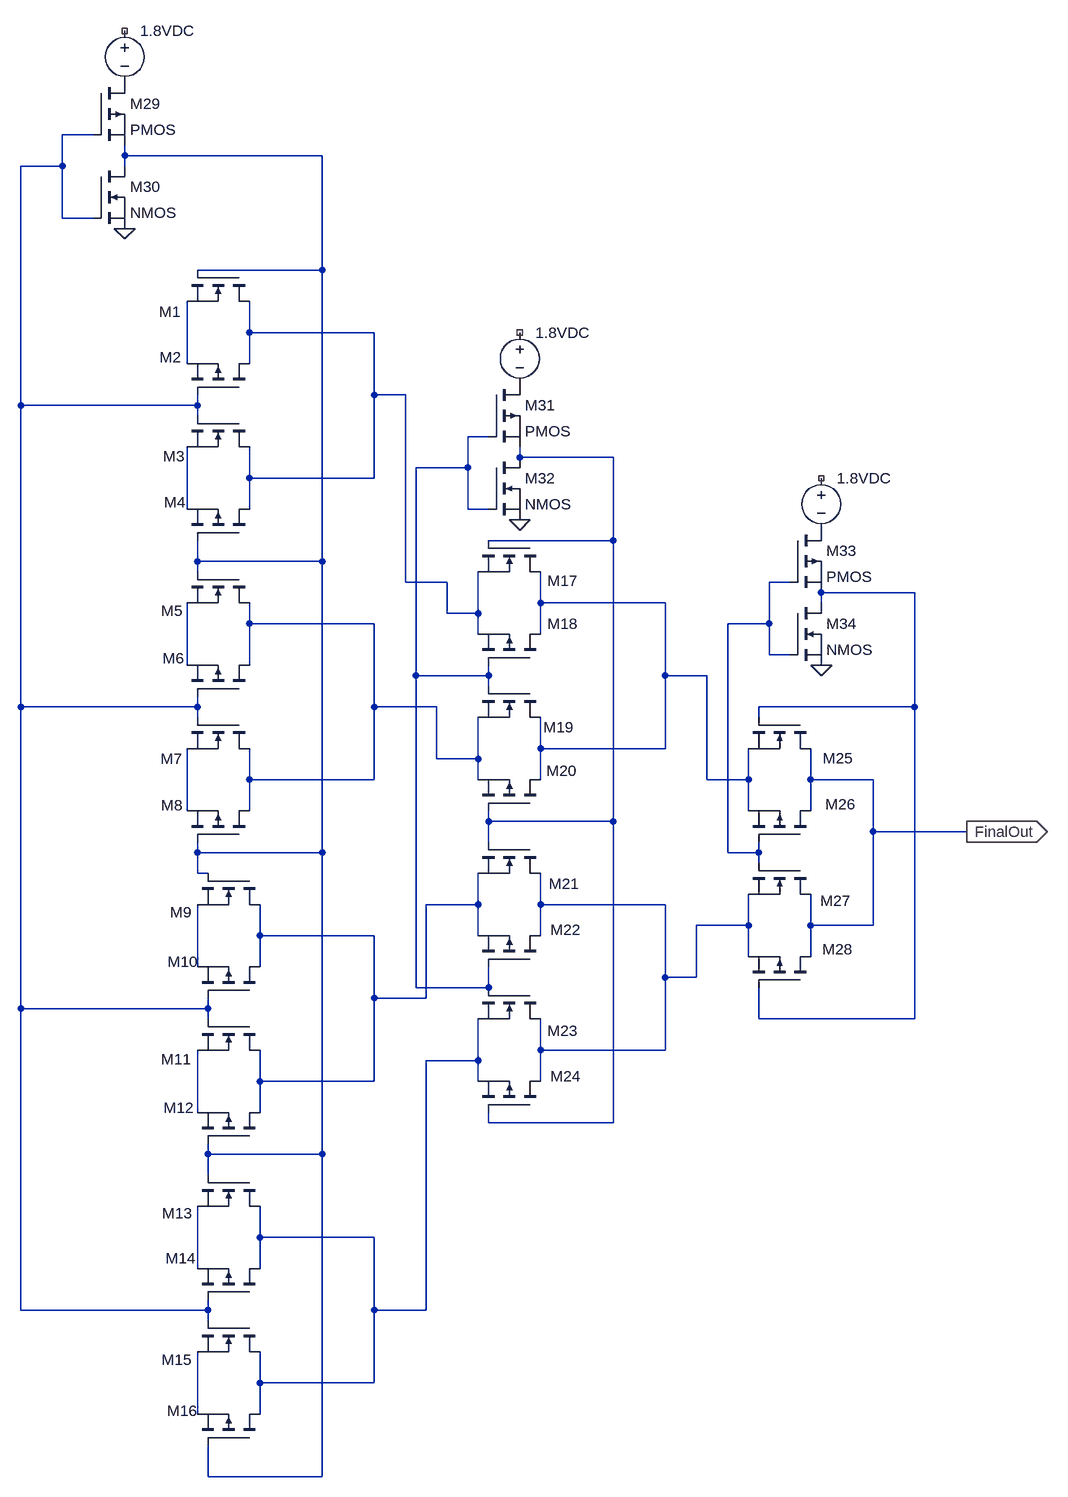
[diagram p0: schematic FInal Schematic.asc]
FInal Schematic.asc, the LTspice schematic file:
Version 4
SHEET 1 1388 680
WIRE -112 -2256 -160 -2256
WIRE -64 -2224 -64 -2240
WIRE 240 -2224 -64 -2224
WIRE -160 -2208 -160 -2256
WIRE -160 -2208 -224 -2208
WIRE -64 -2208 -64 -2224
WIRE -160 -2128 -160 -2208
WIRE -112 -2128 -160 -2128
WIRE 240 -2048 240 -2224
WIRE 240 -2048 48 -2048
WIRE 128 -1952 128 -2000
WIRE 320 -1952 128 -1952
WIRE 32 -1904 32 -2000
WIRE 128 -1904 128 -1952
WIRE 320 -1856 320 -1952
WIRE 368 -1856 320 -1856
WIRE -224 -1840 -224 -2208
WIRE 48 -1840 48 -1856
WIRE 48 -1840 -224 -1840
WIRE 48 -1824 48 -1840
WIRE 496 -1792 464 -1792
WIRE 544 -1760 544 -1776
WIRE 688 -1760 544 -1760
WIRE 464 -1744 464 -1792
WIRE 464 -1744 384 -1744
WIRE 128 -1728 128 -1776
WIRE 320 -1728 320 -1856
WIRE 320 -1728 128 -1728
WIRE 32 -1680 32 -1776
WIRE 128 -1680 128 -1728
WIRE 464 -1680 464 -1744
WIRE 496 -1680 464 -1680
WIRE 688 -1632 688 -1760
WIRE 688 -1632 496 -1632
WIRE 48 -1600 48 -1632
WIRE 240 -1600 240 -2048
WIRE 240 -1600 48 -1600
WIRE 48 -1584 48 -1600
WIRE 368 -1568 368 -1856
WIRE 432 -1568 368 -1568
WIRE 960 -1568 928 -1568
WIRE 1152 -1552 1008 -1552
WIRE 576 -1536 576 -1584
WIRE 768 -1536 576 -1536
WIRE 1008 -1536 1008 -1552
WIRE 432 -1520 432 -1568
WIRE 480 -1520 480 -1584
WIRE 480 -1520 432 -1520
WIRE 128 -1504 128 -1536
WIRE 320 -1504 128 -1504
WIRE 928 -1504 928 -1568
WIRE 928 -1504 864 -1504
WIRE 480 -1488 480 -1520
WIRE 576 -1488 576 -1536
WIRE 928 -1456 928 -1504
WIRE 960 -1456 928 -1456
WIRE 32 -1440 32 -1536
WIRE 128 -1440 128 -1504
WIRE 384 -1424 384 -1744
WIRE 496 -1424 496 -1440
WIRE 496 -1424 384 -1424
WIRE 768 -1424 768 -1536
WIRE 832 -1424 768 -1424
WIRE 496 -1408 496 -1424
WIRE -224 -1376 -224 -1840
WIRE 48 -1376 48 -1392
WIRE 48 -1376 -224 -1376
WIRE 320 -1376 320 -1504
WIRE 416 -1376 320 -1376
WIRE 1152 -1376 1152 -1552
WIRE 1152 -1376 912 -1376
WIRE 48 -1360 48 -1376
WIRE 912 -1360 912 -1376
WIRE 576 -1312 576 -1360
WIRE 768 -1312 768 -1424
WIRE 768 -1312 576 -1312
WIRE 416 -1296 416 -1376
WIRE 480 -1296 480 -1360
WIRE 480 -1296 416 -1296
WIRE 128 -1264 128 -1312
WIRE 320 -1264 320 -1376
WIRE 320 -1264 128 -1264
WIRE 480 -1264 480 -1296
WIRE 576 -1264 576 -1312
WIRE 832 -1264 832 -1424
WIRE 896 -1264 896 -1312
WIRE 896 -1264 832 -1264
WIRE 992 -1264 992 -1312
WIRE 1088 -1264 992 -1264
WIRE 32 -1216 32 -1312
WIRE 128 -1216 128 -1264
WIRE 896 -1216 896 -1264
WIRE 992 -1216 992 -1264
WIRE 496 -1200 496 -1216
WIRE 688 -1200 688 -1632
WIRE 688 -1200 496 -1200
WIRE 1088 -1184 1088 -1264
WIRE 1232 -1184 1088 -1184
WIRE 496 -1168 496 -1200
WIRE 48 -1152 48 -1168
WIRE 240 -1152 240 -1600
WIRE 240 -1152 48 -1152
WIRE 864 -1152 864 -1504
WIRE 912 -1152 912 -1168
WIRE 912 -1152 864 -1152
WIRE 912 -1136 912 -1152
WIRE 48 -1120 48 -1152
WIRE 64 -1120 48 -1120
WIRE 480 -1072 480 -1120
WIRE 480 -1072 400 -1072
WIRE 576 -1072 576 -1120
WIRE 768 -1072 576 -1072
WIRE 896 -1040 896 -1088
WIRE 896 -1040 816 -1040
WIRE 992 -1040 992 -1088
WIRE 1088 -1040 1088 -1184
WIRE 1088 -1040 992 -1040
WIRE 144 -1024 144 -1072
WIRE 320 -1024 144 -1024
WIRE 480 -1024 480 -1072
WIRE 576 -1024 576 -1072
WIRE 896 -992 896 -1040
WIRE 992 -992 992 -1040
WIRE 48 -976 48 -1072
WIRE 144 -976 144 -1024
WIRE 768 -960 768 -1072
WIRE 816 -960 816 -1040
WIRE 816 -960 768 -960
WIRE 384 -944 384 -1424
WIRE 496 -944 496 -976
WIRE 496 -944 384 -944
WIRE 320 -928 320 -1024
WIRE 400 -928 400 -1072
WIRE 400 -928 320 -928
WIRE -224 -912 -224 -1376
WIRE 64 -912 64 -928
WIRE 64 -912 -224 -912
WIRE 64 -896 64 -912
WIRE 912 -896 912 -944
WIRE 1152 -896 1152 -1376
WIRE 1152 -896 912 -896
WIRE 576 -848 576 -896
WIRE 768 -848 768 -960
WIRE 768 -848 576 -848
WIRE 480 -832 480 -896
WIRE 480 -832 400 -832
WIRE 144 -800 144 -848
WIRE 320 -800 320 -928
WIRE 320 -800 144 -800
WIRE 480 -800 480 -832
WIRE 576 -800 576 -848
WIRE 48 -752 48 -848
WIRE 144 -752 144 -800
WIRE 496 -736 496 -752
WIRE 688 -736 688 -1200
WIRE 688 -736 496 -736
WIRE 64 -688 64 -704
WIRE 240 -688 240 -1152
WIRE 240 -688 64 -688
WIRE 64 -656 64 -688
WIRE 144 -560 144 -608
WIRE 320 -560 144 -560
WIRE 48 -512 48 -608
WIRE 144 -512 144 -560
WIRE -224 -448 -224 -912
WIRE 64 -448 64 -464
WIRE 64 -448 -224 -448
WIRE 320 -448 320 -560
WIRE 400 -448 400 -832
WIRE 400 -448 320 -448
WIRE 64 -432 64 -448
WIRE 144 -336 144 -384
WIRE 320 -336 320 -448
WIRE 320 -336 144 -336
WIRE 48 -288 48 -384
WIRE 144 -288 144 -336
WIRE 64 -192 64 -240
WIRE 240 -192 240 -688
WIRE 240 -192 64 -192
FLAG 1232 -1184 FinalOut
IOPIN 1232 -1184 Out
FLAG 1008 -1440 0
FLAG -64 -2112 0
FLAG 544 -1664 0
SYMBOL nmos 144 -656 R90
WINDOW 0 59 103 VRight 2
SYMATTR InstName M13
SYMATTR Value ""
SYMBOL pmos 144 -464 M270
WINDOW 0 64 145 VLeft 2
SYMATTR InstName M14
SYMATTR Value ""
SYMBOL nmos 144 -432 R90
WINDOW 0 60 104 VRight 2
SYMATTR InstName M15
SYMATTR Value ""
SYMBOL pmos 144 -240 M270
WINDOW 0 53 143 VLeft 2
SYMATTR InstName M16
SYMATTR Value ""
SYMBOL nmos 144 -1120 R90
WINDOW 0 60 104 VRight 2
SYMATTR InstName M9
SYMATTR Value ""
SYMBOL pmos 144 -928 M270
WINDOW 0 56 142 VLeft 2
SYMATTR InstName M10
SYMATTR Value ""
SYMBOL nmos 144 -896 R90
WINDOW 0 62 105 VRight 2
SYMATTR InstName M11
SYMATTR Value ""
SYMBOL pmos 144 -704 M270
WINDOW 0 55 148 VLeft 2
SYMATTR InstName M12
SYMATTR Value ""
SYMBOL nmos 128 -1584 R90
WINDOW 0 60 102 VRight 2
SYMATTR InstName M5
SYMATTR Value ""
SYMBOL pmos 128 -1392 M270
WINDOW 0 59 134 VLeft 2
SYMATTR InstName M6
SYMATTR Value ""
SYMBOL nmos 128 -1360 R90
WINDOW 0 64 103 VRight 2
SYMATTR InstName M7
SYMATTR Value ""
SYMBOL pmos 128 -1168 M270
WINDOW 0 57 136 VLeft 2
SYMATTR InstName M8
SYMATTR Value ""
SYMBOL nmos 128 -2048 R90
WINDOW 0 64 105 VRight 2
SYMATTR InstName M1
SYMATTR Value ""
SYMBOL pmos 128 -1856 M270
WINDOW 0 58 138 VLeft 2
SYMATTR InstName M2
SYMATTR Value ""
SYMBOL nmos 128 -1824 R90
WINDOW 0 62 99 VRight 2
SYMATTR InstName M3
SYMATTR Value ""
SYMBOL pmos 128 -1632 M270
WINDOW 0 59 131 VLeft 2
SYMATTR InstName M4
SYMATTR Value ""
SYMBOL nmos 576 -1168 R90
WINDOW 0 64 -60 VRight 2
SYMATTR InstName M21
SYMATTR Value ""
SYMBOL pmos 576 -976 M270
WINDOW 0 57 -15 VLeft 2
SYMATTR InstName M22
SYMATTR Value ""
SYMBOL nmos 576 -944 R90
WINDOW 0 66 -58 VRight 2
SYMATTR InstName M23
SYMATTR Value ""
SYMBOL pmos 576 -752 M270
WINDOW 0 56 -15 VLeft 2
SYMATTR InstName M24
SYMATTR Value ""
SYMBOL nmos 576 -1632 R90
WINDOW 0 128 -58 VRight 2
SYMATTR InstName M18
SYMATTR Value ""
SYMBOL pmos 576 -1440 M270
WINDOW 0 130 -11 VLeft 2
SYMATTR InstName M17
SYMATTR Value ""
SYMBOL nmos 576 -1408 R90
WINDOW 0 63 -52 VRight 2
SYMATTR InstName M19
SYMATTR Value ""
SYMBOL pmos 576 -1216 M270
WINDOW 0 62 -9 VLeft 2
SYMATTR InstName M20
SYMATTR Value ""
SYMBOL nmos 992 -1360 R90
WINDOW 0 63 -66 VRight 2
SYMATTR InstName M25
SYMATTR Value ""
SYMBOL pmos 992 -1168 M270
WINDOW 0 58 -22 VLeft 2
SYMATTR InstName M26
SYMATTR Value ""
SYMBOL nmos 992 -1136 R90
WINDOW 0 58 -62 VRight 2
SYMATTR InstName M27
SYMATTR Value ""
SYMBOL pmos 992 -944 M270
WINDOW 0 59 -18 VLeft 2
SYMATTR InstName M28
SYMATTR Value ""
SYMBOL nmos -112 -2208 R0
SYMATTR InstName M30
SYMBOL pmos -112 -2336 R0
SYMATTR InstName M29
SYMBOL pmos 496 -1872 R0
SYMATTR InstName M31
SYMBOL pmos 960 -1648 R0
SYMATTR InstName M33
SYMBOL nmos 496 -1760 R0
SYMATTR InstName M32
SYMBOL nmos 960 -1536 R0
SYMATTR InstName M34
SYMBOL voltage 544 -1968 R0
SYMATTR InstName 1.8VDC
SYMATTR Value ""
SYMBOL voltage 1008 -1744 R0
SYMATTR InstName 1.8VDC
SYMATTR Value ""
SYMBOL voltage -64 -2432 R0
SYMATTR InstName 1.8VDC
SYMATTR Value ""

The netlist it stands for:
* FInal Schematic.asc
M13 N017 N002 N019 N019
M14 N017 N001 N019 N019
M15 N017 N001 N020 N020
M16 N017 N002 N020 N020
M9 N014 N002 N016 N016
M10 N014 N001 N016 N016
M11 N014 N001 N018 N018
M12 N014 N002 N018 N018
M5 N011 N002 N012 N012
M6 N011 N001 N012 N012
M7 N011 N001 N013 N013
M8 N011 N002 N013 N013
M1 N003 N002 N004 N004
M2 N003 N001 N004 N004
M3 N003 N001 N007 N007
M4 N003 N002 N007 N007
M21 N015 N006 N014 N014
M22 N015 N005 N014 N014
M23 N015 N005 N017 N017
M24 N015 N006 N017 N017
M18 N010 N006 N003 N003
M17 N010 N005 N003 N003
M19 N010 N005 N011 N011
M20 N010 N006 N011 N011
M25 FinalOut N009 N010 N010
M26 FinalOut N008 N010 N010
M27 FinalOut N008 N015 N015
M28 FinalOut N009 N015 N015
M30 N002 N001 0 0 NMOS
M29 P001 N001 N002 N002 PMOS
M31 P002 N005 N006 N006 PMOS
M33 P003 N008 N009 N009 PMOS
M32 N006 N005 0 0 NMOS
M34 N009 N008 0 0 NMOS
V§1.8VDC NC_01 P002
V§1.8VDC NC_02 P003
V§1.8VDC NC_03 P001
.model NMOS NMOS
.model PMOS PMOS
.lib standard.mos
.backanno
.end